# Altium schematic sheet IMU.SchDoc: =project_title
size Tabloid; CompanyName: Luxonis Holding; Organization: Luxonis Holding; Address1: 1925 Harmony Park Drive; Address2: Westminster, CO; Address3: 80234; Address4: United States; SheetNumber: 9; SheetTotal: 13
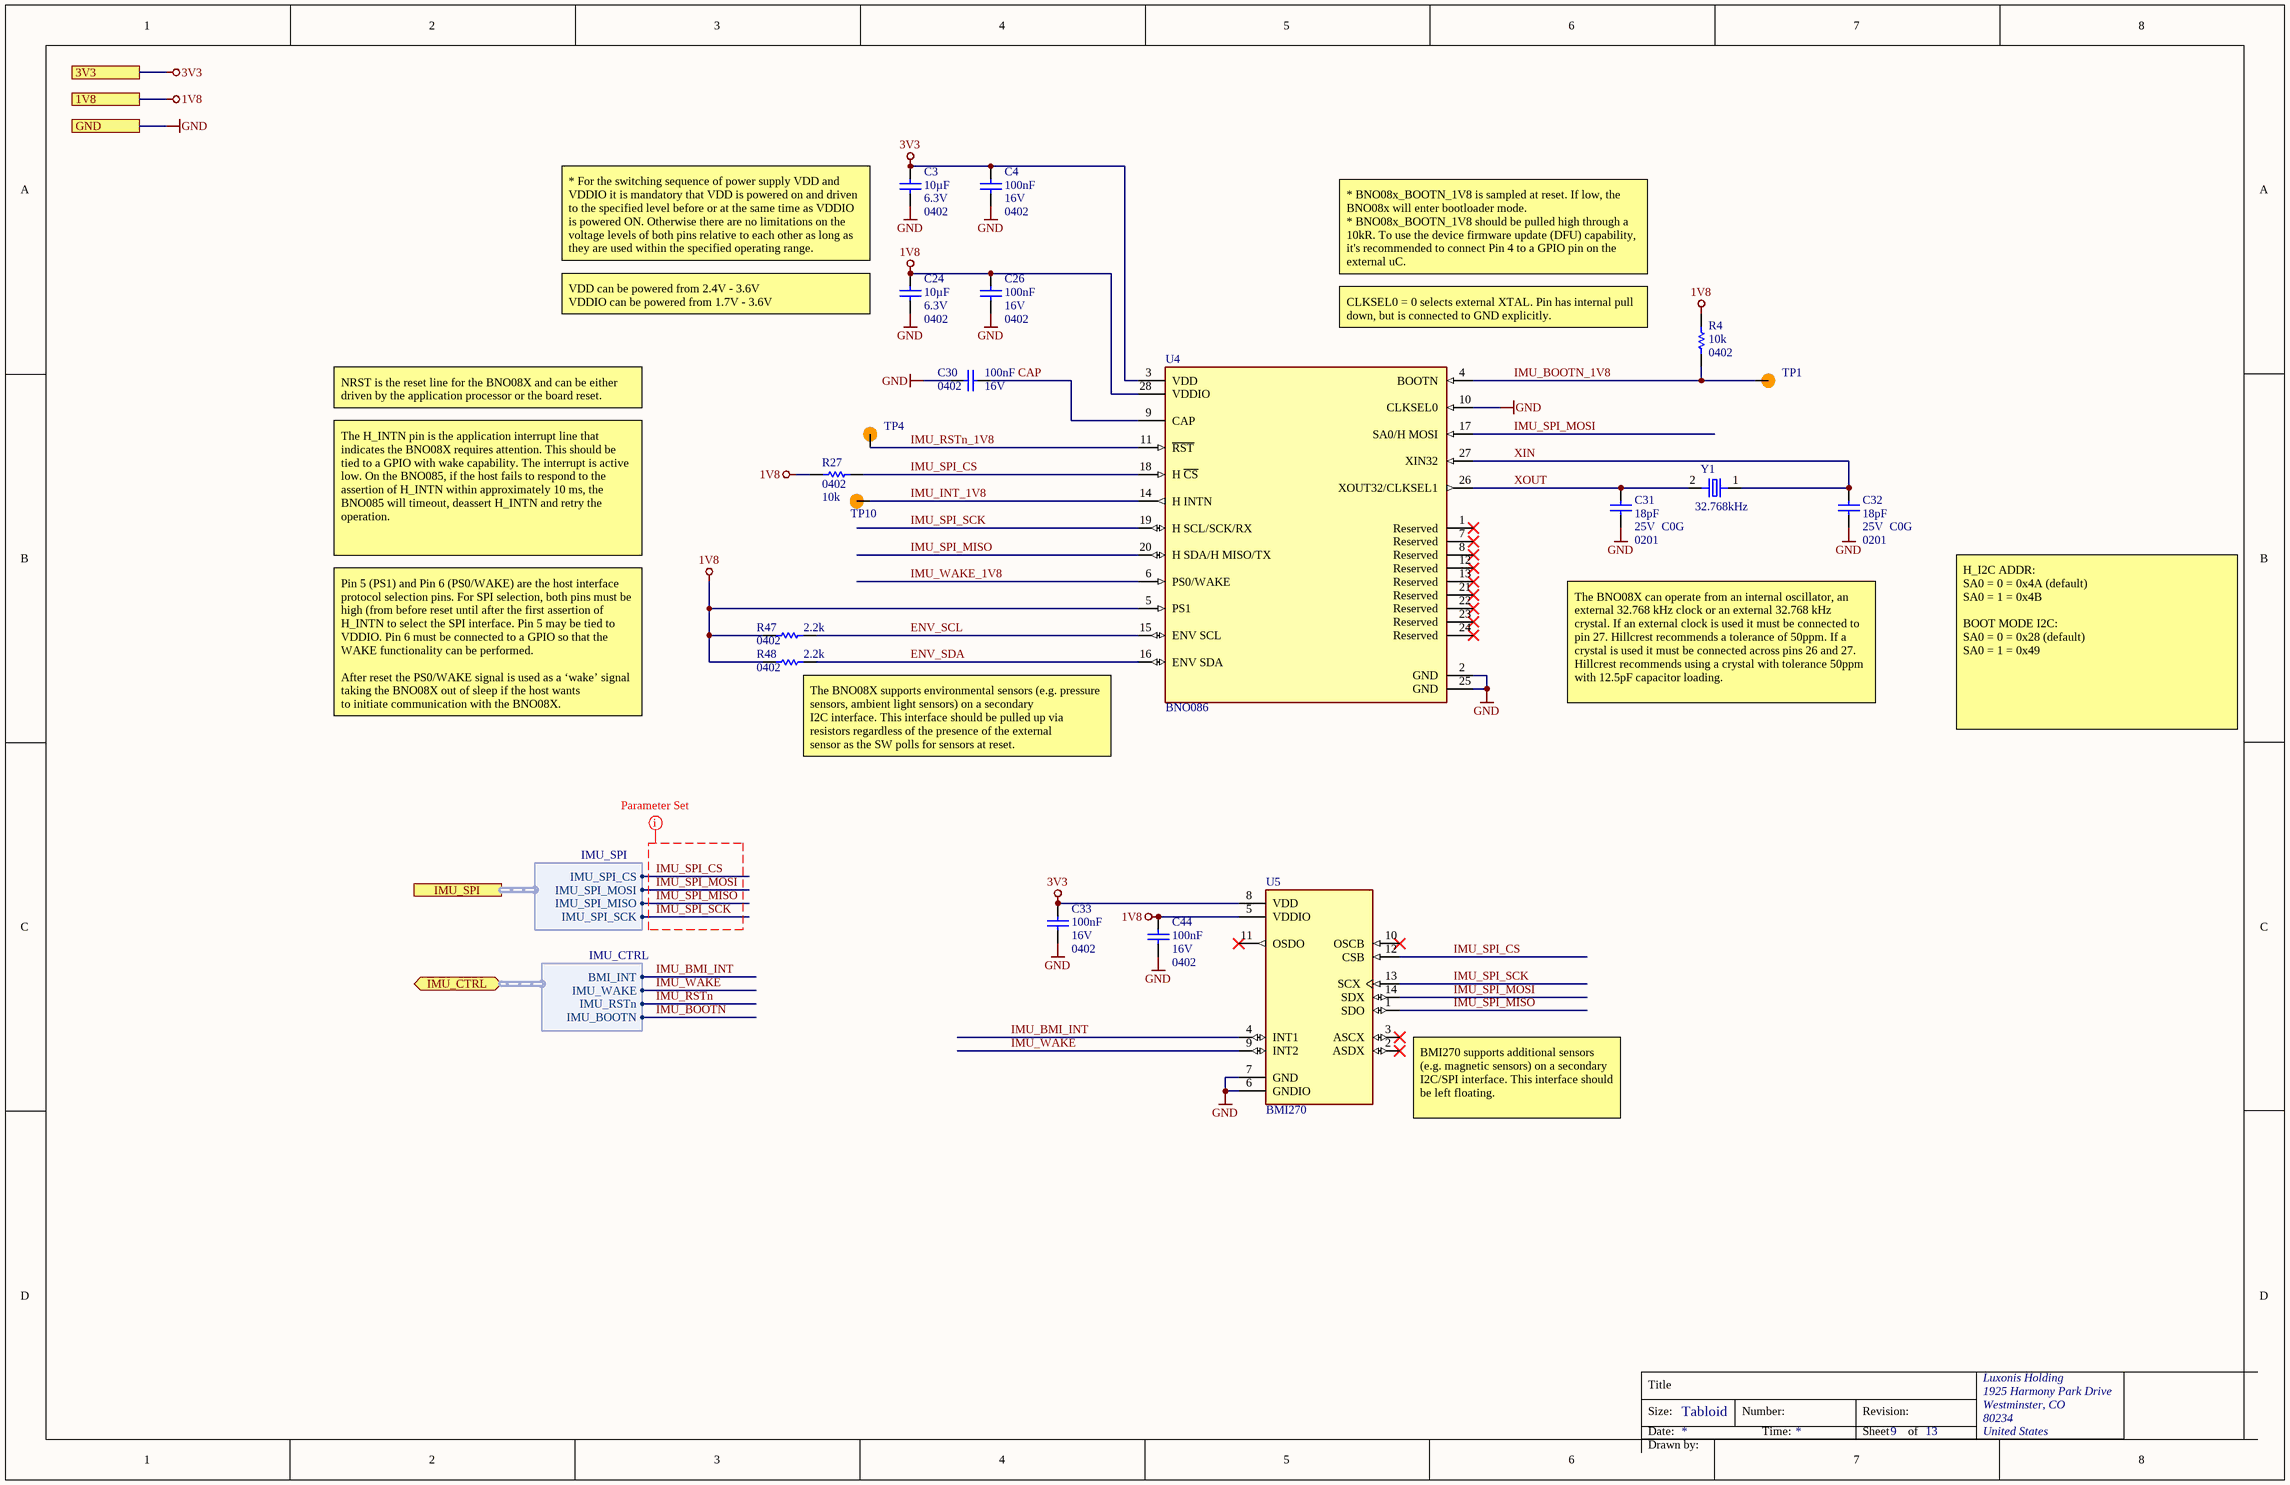
[diagram p0: IMU.SchDoc]

## Parts
C3  value 10µF  Voltage Rating: 6.3V  Case/Package: 0402  [CAPC0402(1005)70_L]  (hidden comment: GRM155R60J106ME15D)
C4  value 100nF  Voltage Rating: 16V  Case/Package: 0402  [CAPC0402(1005)60_L]  (hidden comment: CL05B104KO5NFNC)
C24  value 10µF  Voltage Rating: 6.3V  Case/Package: 0402  [CAPC0402(1005)70_L]  (hidden comment: GRM155R60J106ME15D)
C26  value 100nF  Voltage Rating: 16V  Case/Package: 0402  [CAPC0402(1005)60_L]  (hidden comment: CL05B104KO5NFNC)
C30  value 100nF  Voltage Rating: 16V  Case/Package: 0402  [CAPC0402(1005)60_L]  (hidden comment: CL05B104KO5NFNC)
C31  value 18pF  Case/Package: 0201  Voltage Rating: 25V  Dielectric: C0G  [CAPC0201(0603)33_L]  (hidden comment: GRM0335C1E180FA01D)
C32  value 18pF  Case/Package: 0201  Voltage Rating: 25V  Dielectric: C0G  [CAPC0201(0603)33_L]  (hidden comment: GRM0335C1E180FA01D)
C33  value 100nF  Voltage Rating: 16V  Case/Package: 0402  [CAPC0402(1005)60_L]  (hidden comment: CL05B104KO5NFNC)
C44  value 100nF  Voltage Rating: 16V  Case/Package: 0402  [CAPC0402(1005)60_L]  (hidden comment: CL05B104KO5NFNC)
R4  value 10k  Case/Package: 0402  [RESC0402(1005)_L]  (hidden comment: RC0402FR-1310KL)
R27  value 10k  Case/Package: 0402  [RESC0402(1005)_L]  (hidden comment: RC0402FR-1310KL)
R47  value 2.2k  Case/Package: 0402  [RESC0402(1005)_L]  (hidden comment: RC0402FR-072K2L)
R48  value 2.2k  Case/Package: 0402  [RESC0402(1005)_L]  (hidden comment: RC0402FR-072K2L)
TP1  TEST_POINT  [TP075_150_NS]  (value not drawn)  (no BOM)
TP4  TEST_POINT  [TP075_150_NS]  (value not drawn)  (no BOM)
TP10  TEST_POINT  [TP075_150_NS]  (value not drawn)  (no BOM)
U4  BNO086  [BNO086]
U5  BMI270  [XDCR_BMI270]
Y1  Frequency: 32.768kHz  [ABS06-127-32.768KHZ-T]  (hidden comment: ABS06-127-32.768KHZ-T)

## Ports
1V8, 3V3, GND, IMU_CTRL (bidir, harness IMU_CTRL), IMU_SPI (harness IMU_SPI)

## Harnesses
IMU_CTRL: BMI_INT, IMU_WAKE, IMU_RSTn, IMU_BOOTN
IMU_SPI: IMU_SPI_CS, IMU_SPI_MOSI, IMU_SPI_MISO, IMU_SPI_SCK

## Nets
1V8: C24.2 C26.2 C44.2 R4.2 R27.2 R47.1 R48.1 U4.5(PS1) U4.28(VDDIO) U5.5(VDDIO) ; port 1V8
3V3: C3.2 C4.2 C33.2 U4.3(VDD) U5.8(VDD) ; port 3V3
GND: C3.1 C4.1 C24.1 C26.1 C30.2 C31.1 C32.1 C33.1 C44.1 U4.2(GND) U4.10(CLKSEL0) U4.25(GND) U5.6(GNDIO) U5.7(GND) ; port GND
CAP: C30.1 U4.9(CAP)
ENV_SCL: R47.2 U4.15(ENV_SCL)
ENV_SDA: R48.2 U4.16(ENV_SDA)
IMU_BMI_INT: U5.4(INT1) ; port IMU_CTRL.BMI_INT
IMU_BOOTN: port IMU_CTRL.IMU_BOOTN
IMU_BOOTN_1V8: R4.1 TP1.1 U4.4(BOOTN)
IMU_INT_1V8: TP10.1 U4.14(H_INTN)
IMU_RSTn: port IMU_CTRL.IMU_RSTn
IMU_RSTn_1V8: TP4.1 U4.11(~{RST})
IMU_SPI_CS: R27.1 U4.18(H_~{CS}) U5.12(CSB) ; port IMU_SPI.IMU_SPI_CS
IMU_SPI_MISO: U4.20(H_SDA/H_MISO/TX) U5.1(SDO) ; port IMU_SPI.IMU_SPI_MISO
IMU_SPI_MOSI: U4.17(SA0/H_MOSI) U5.14(SDX) ; port IMU_SPI.IMU_SPI_MOSI
IMU_SPI_SCK: U4.19(H_SCL/SCK/RX) U5.13(SCX) ; port IMU_SPI.IMU_SPI_SCK
IMU_WAKE: U5.9(INT2) ; port IMU_CTRL.IMU_WAKE
IMU_WAKE_1V8: U4.6(PS0/WAKE)
XIN: C32.2 U4.27(XIN32) Y1.1
XOUT: C31.2 U4.26(XOUT32/CLKSEL1) Y1.2

Not connected (* = marked no-connect by the designer): U4 1(Reserved)* 7(Reserved)* 8(Reserved)* 12(Reserved)* 13(Reserved)* 21(Reserved)* 22(Reserved)* 23(Reserved)* 24(Reserved)*; U5 2(ASDX)* 3(ASCX)* 10(OSCB)* 11(OSDO)*

## Layout directives
net class IMU_SPI: IMU_SPI_CS, IMU_SPI_MISO, IMU_SPI_MOSI, IMU_SPI_SCK

## Notes on the sheet
- * For the switching sequence of power supply VDD and VDDIO it is mandatory that VDD is powered on and driven to the specified level before or at the same time as VDDIO is powered ON. Otherwise there are no limitations on the voltage levels of both pins relative to each other as long as they are used within the specified operating range.
- * BNO08x_BOOTN_1V8 is sampled at reset. If low, the BNO08x will enter bootloader mode.
  * BNO08x_BOOTN_1V8 should be pulled high through a 10kR. To use the device firmware update (DFU) capability, it's recommended to connect Pin 4 to a GPIO pin on the external uC.
- (near C24) VDD can be powered from 2.4V - 3.6V
  VDDIO can be powered from 1.7V - 3.6V
- CLKSEL0 = 0 selects external XTAL. Pin has internal pull down, but is connected to GND explicitly.
- NRST is the reset line for the BNO08X and can be either driven by the application processor or the board reset.
- The H_INTN pin is the application interrupt line that indicates the BNO08X requires attention. This should be tied to a GPIO with wake capability. The interrupt is active low. On the BNO085, if the host fails to respond to the assertion of H_INTN within approximately 10 ms, the BNO085 will timeout, deassert H_INTN and retry the operation.
- The BNO08X can operate from an internal oscillator, an external 32.768 kHz clock or an external 32.768 kHz crystal. If an external clock is used it must be connected to pin 27. Hillcrest recommends a tolerance of 50ppm. If a crystal is used it must be connected across pins 26 and 27. Hillcrest recommends using a crystal with tolerance 50ppm with 12.5pF capacitor loading.
- Pin 5 (PS1) and Pin 6 (PS0/WAKE) are the host interface protocol selection pins. For SPI selection, both pins must be high (from before reset until after the first assertion of H_INTN to select the SPI interface. Pin 5 may be tied to VDDIO. Pin 6 must be connected to a GPIO so that the WAKE functionality can be performed.
  After reset the PS0/WAKE signal is used as a ‘wake’ signal taking the BNO08X out of sleep if the host wants
  to initiate communication with the BNO08X.
- (near R48) The BNO08X supports environmental sensors (e.g. pressure sensors, ambient light sensors) on a secondary
  I2C interface. This interface should be pulled up via resistors regardless of the presence of the external
  sensor as the SW polls for sensors at reset.
- H_I2C ADDR:
  SA0 = 0 = 0x4A (default)
  SA0 = 1 = 0x4B
  BOOT MODE I2C:
  SA0 = 0 = 0x28 (default)
  SA0 = 1 = 0x49
- (near U5) BMI270 supports additional sensors (e.g. magnetic sensors) on a secondary I2C/SPI interface. This interface should be left floating.
- Title
- Size:
- Date:
- Tabloid
- Number:
- Time:
- Revision:
- Sheet
- of
- Drawn by:

## Library data of the parts
C3 C24 = CMP-004-000009-5: CAP CER 10UF 6.3V X5R 0402 20%; Manufacturer 1: Murata; Dielectric: X5R; Manufacturer Part Number 1: GRM155R60J106ME15D; ComponentLink1URL: https://www.murata.com/~/media/webrenewal/support/library/catalog/products/capacitor/mlcc/c02e.ashx?la=en-us&src-supplier=Digi-Key; Design Item ID: GRM155R60J106ME15D; Tolerance: 20%; Width: 0.02inch; Length: 0.039inch; Mounting Technology: SMT; Min Operating Temperature: -55°C; Max Operating Temperature: 85°C; ComponentLink1Description: https://www.murata.com/~/media/webrenewal/support/library/catalog/products/capacitor/mlcc/c02e.ashx?la=en-us&src-supplier=Digi-Key
C4 C26 C30 C33 C44 = CMP-108-000002-6: CAP CER 0.1UF 16V X7R 0402 10%; Manufacturer 1: Samsung; ComponentLink1URL: https://datasheet.ciiva.com/25767/cl05b104ko5nfnc-25767124.pdf?src-supplier=Digi-Key; Length: 1mm; Design Item ID: CL05B104KO5NFNC; Tolerance: 10%; Min Operating Temperature: -55°C; Width: 0.02inch; Dielectric: X7R; ComponentLink1Description: https://datasheet.ciiva.com/25767/cl05b104ko5nfnc-25767124.pdf?src-supplier=Digi-Key; Height: 0.5mm; Depth: 0.5mm; Manufacturer Part Number 1: CL05B104KO5NFNC; Max Operating Temperature: 125°C; Mounting Technology: SMT
C31 C32 = CMP-004-000003-6: CAP CER 18PF 25V C0G 0201 10%; Manufacturer 1: Murata; Tolerance: 1%; Manufacturer Part Number 1: GRM0335C1E180FA01D; Min Operating Temperature: -55°C; Max Operating Temperature: 125°C; Length: 0.024inch; Height: 0.3mm; Width: 0.3mm; ComponentLink1URL: https://datasheet.ciiva.com/29538/partnumbering-e-01-29538328.pdf?src-supplier=Digi-Key; ComponentLink1Description: https://datasheet.ciiva.com/29538/partnumbering-e-01-29538328.pdf?src-supplier=Digi-Key; Design Item ID: GRM0335C1E180FA01D; Mounting Technology: SMT
R4 R27 = CMP-115-000004-8: RES SMD 10K OHM 1% 1/16W 0402; Manufacturer 1: Yageo; Temperature Coefficient: 100ppm/°C; Power Rating: 62.5mW; Voltage Rating: 50V; Manufacturer Part Number 1: RC0402FR-1310KL; Min Operating Temperature: -55°C; Max Operating Temperature: 155°C; Tolerance: 1%; Design Item ID: RC0402FR-1310KL
R47 R48 = CMP-013-000013-8: RES SMD 2.2K OHM 1% 1/16W 0402; Manufacturer 1: Yageo; Power Rating: 63mW; Voltage Rating: 50V; Manufacturer Part Number 1: RC0402FR-072K2L; Min Operating Temperature: -55°C; Max Operating Temperature: 155°C; Tolerance: 1%; Design Item ID: RC0402FR-072K2L
TP1 TP4 TP10 = CMP-015-000000-2: Manufacturer Part Number 1: /; Design Item ID: TEST_POINT; Source: LuxonisMaster.SchLib
U4 = CMP-010-00028-1: Accelerometer, Gyroscope, Magnetometer, 9 Axis Sensor I²C, SPI, UART Output; Manufacturer 1: CEVA Technologies, Inc.; Manufacturer Part Number 1: BNO086
U5 = CMP-061-000001-3: Accelerometer, Gyroscope, 6 Axis Sensor IÂ²C, SPI Output; Manufacturer 1: Bosch Sensortec; Manufacturer Part Number 1: BMI270
Y1 = CMP-006-000001-2: CRYSTAL 32.768kHz ±20ppm Crystal 12.5pF 90 kOhms 2-SMD, No Lead; Manufacturer 1: Abracon; Manufacturer Part Number 1: ABS06-127-32.768KHZ-T; Case/Package: SMD/SMT; Min Operating Temperature: -40°C; Max Operating Temperature: 85°C; Tolerance: 20ppm